# EAGLE design patch-panel (EAGLE 7.5.0)
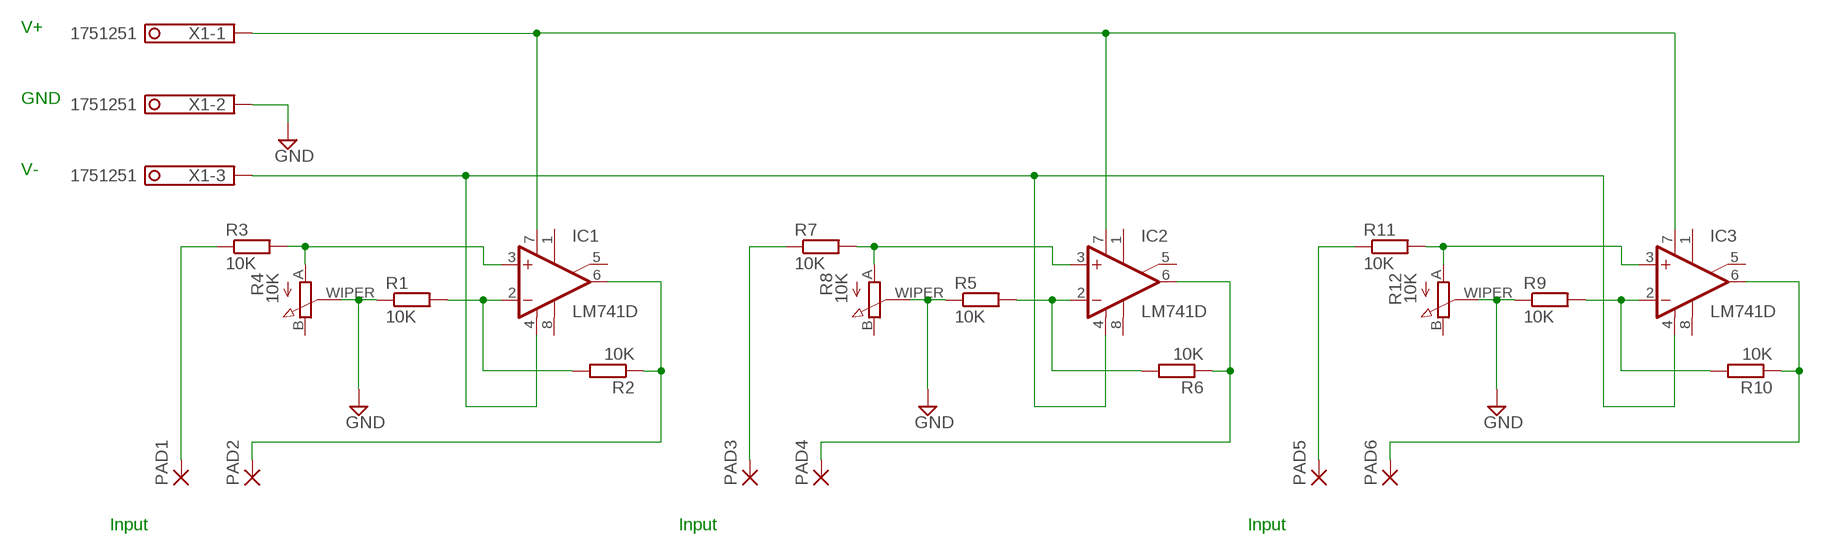
[diagram p0: schematic, sheet 1]

## Parts
IC1  LM741D  [SO08]
IC2  LM741D  [SO08]
IC3  LM741D  [SO08]
PAD1  2,54/1,0  [2,54/1,0]
PAD2  2,54/1,0  [2,54/1,0]
PAD3  2,54/1,0  [2,54/1,0]
PAD4  2,54/1,0  [2,54/1,0]
PAD5  2,54/1,0  [2,54/1,0]
PAD6  2,54/1,0  [2,54/1,0]
R1  10K  R-EU_M1206  [M1206]
R2  10K  R-EU_M1206  [M1206]
R3  10K  R-EU_M1206  [M1206]
R4  10K  PTVA09A-4  [PTVA09A-4]
R5  10K  R-EU_M1206  [M1206]
R6  10K  R-EU_M1206  [M1206]
R7  10K  R-EU_M1206  [M1206]
R8  10K  PTVA09A-4  [PTVA09A-4]
R9  10K  R-EU_M1206  [M1206]
R10  10K  R-EU_M1206  [M1206]
R11  10K  R-EU_M1206  [M1206]
R12  10K  PTVA09A-4  [PTVA09A-4]
X1  1751251  [1751251]

## Nets
N$1: IC1.2(-IN) R1.2 R2.2
N$2: IC1.6(OUT) PAD2.1(P) R2.1
N$3: IC1.3(+IN) R3.2 R4.A
N$5: R1.1 R4.WIPER R5.1 R8.WIPER R9.1 R12.WIPER X1.2 ; supply symbol labelled GND
N$6: PAD1.1(P) R3.1
N$7: IC2.2(-IN) R5.2 R6.2
N$8: IC2.6(OUT) PAD4.1(P) R6.1
N$9: IC2.3(+IN) R7.2 R8.A
N$10: PAD3.1(P) R7.1
N$11: IC1.7(V+) IC2.7(V+) IC3.7(V+) X1.1
N$14: IC3.2(-IN) R9.2 R10.2
N$15: IC3.6(OUT) PAD6.1(P) R10.1
N$16: IC3.3(+IN) R11.2 R12.A
N$17: PAD5.1(P) R11.1
N$40: IC1.4(V-) IC2.4(V-) IC3.4(V-) X1.3
Unconnected: IC1.1(ON1) IC1.5(ON2) IC1.8(OPT) IC2.1(ON1) IC2.5(ON2) IC2.8(OPT) IC3.1(ON1) IC3.5(ON2) IC3.8(OPT) R4.B R8.B R12.B

## Notes on the sheet
- V+
- GND
- V-
- Input | Input | Input

## Library data of the parts
IC1-IC3 = linear:*741: OP AMP
PAD1-PAD6 = wirepad:2,54/1,0: THROUGH-HOLE PAD
R1-R3 R5-R7 R9-R11 = rcl:R-EU_: RESISTOR, European symbol
R4 R8 R12 = bourns-PTVA09A-4:PTVA09A-4
X1 = con-phoenix-350:1751251: MKDS 1/ 3-3,5 Printklemme Nennstrom: 10 A Bemessungsspannung: 160 V Raster: 3,5 mm Polzahl: 3 Montageart: Löten Anschlussart: Schraubanschluss Anschlussrichtung vom Leiter zur Platine: 0° Source: http://eshop.phoenixcontact.com .. 1751251.pdf; OC_FARNELL: unknown; OC_NEWARK: unknown

## Board
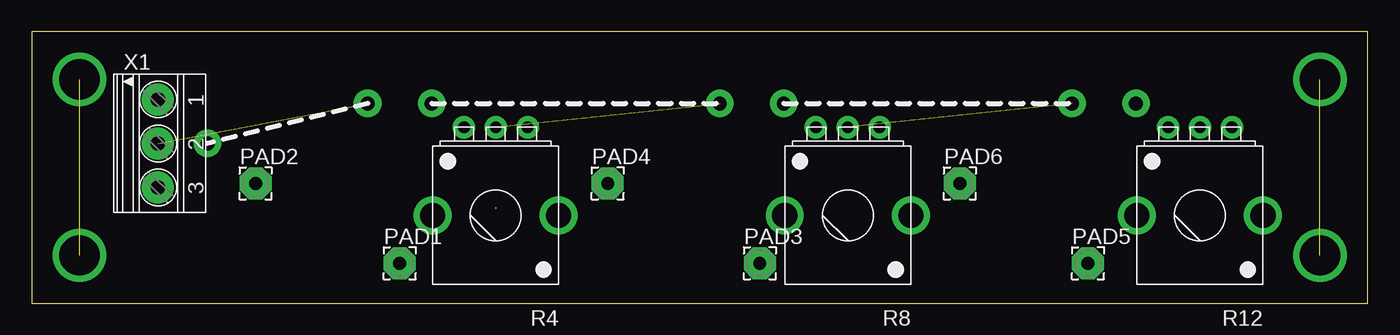
[diagram p1: board, top side]
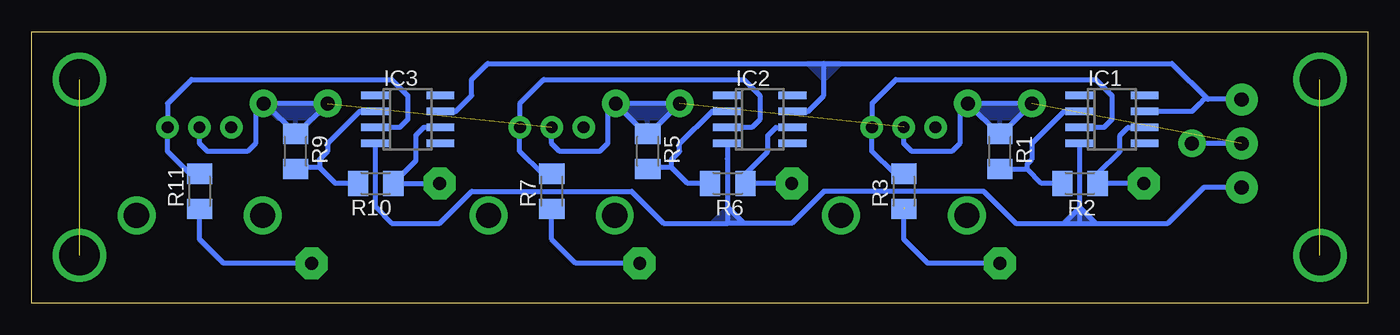
[diagram p2: board, bottom side, seen from below]

Size 106.05 x 21.59 mm. Coordinates in mm from the lower left corner, seen from the top.
Outline: 0,0 106.05,0 106.05,21.59 0,21.59 0,0
Copper layers (1*16): Top 0.035mm / dielectric 1.5mm / Bottom 0.035mm
Design rules "default": minimum track width 10mil, minimum drill 24mil, track to track 8mil, track to pad 8mil, pad to pad 8mil, via to via 8mil, smd to smd 8mil, copper to edge 40mil, drill to drill 8mil, minimum pad ring 10mil, minimum via ring 8mil, stop-mask expansion 4mil, vias tented up to drill 0mil, thermal gap 10mil

### Footprints (pad centres in the part's own frame; a part is rotated, then mirrored left to right if it is on the bottom)
SO08 = smd 0.6 x 2.2: 1 -1.905,-2.6; 2 -0.635,-2.6; 3 0.635,-2.6; 4 1.905,-2.6; 5 1.905,2.6; 6 0.635,2.6; 7 -0.635,2.6; 8 -1.905,2.6
2,54/1,0 = drill 1.016 pad 2.54 octagon: 1 0,0
M1206 = smd 1.6 x 2: 1 -1.4,0; 2 1.4,0
PTVA09A-4 = drill 0.9 pad 1.5: A -2.5,-7; B 2.5,-7; WIPER 0,-7 | drill 2 pad 2.54: P$4 -5,0; P$5 5,0
1751251 = drill 1.1 pad 1.7: 1 -3.5,-0.1; 2 0,-0.1; 3 3.5,-0.1

### Placement (x,y rotation side)
IC1  20.32,14.61 270 bottom
IC2  48.26,14.61 270 bottom
IC3  76.2,14.61 270 bottom
PAD1  29.21,3.17 0 top
PAD2  17.78,9.53 0 top
PAD3  57.78,3.17 0 top
PAD4  45.72,9.53 0 top
PAD5  83.82,3.17 0 top
PAD6  73.66,9.53 0 top
R1  29.21,12.06 270 bottom
R2  22.86,9.53 180 bottom
R3  36.83,8.89 90 bottom
R4  36.83,6.99 180 top
R5  57.15,12.06 270 bottom
R6  50.8,9.53 180 bottom
R7  64.77,8.89 90 bottom
R8  64.77,6.99 180 top
R9  85.09,12.06 270 bottom
R10  78.74,9.53 180 bottom
R11  92.71,8.89 90 bottom
R12  92.71,6.99 180 top
X1  10.16,12.7 270 top

### Tracks (layer width: path | path; a pad name or v marks a point on that pad's centre or on a via)
N$1
  Bottom 0.406: IC1.2 24.13,15.24 26.67,12.7 26.67,11.43 27.05,11.05 27.05,10.66 | R1.2 27.05,10.66 | R2.2 25.91,9.53 27.05,10.66
N$2
  Bottom 0.406: IC1.6 19.05,13.97 19.68,13.34 19.68,12.06 21.46,10.29 R2.1 PAD2.1
N$3
  Bottom 0.406: IC1.3 20.95,13.97 20.32,14.61 20.32,16.51 21.59,17.78 37.47,17.78 39.33,15.91 R4.A 39.37,13.95 39.37,12.06 37.59,10.29 R3.2
N$5  (via drill 0.9 pad 1.78, 1.1 pad 2.18)  (4 unrouted)
  Bottom 0.406: R1.1 29.34,13.46 | 29.34,13.46 29.21,13.34 v26.67,15.88 v31.75,15.88 | v31.75,15.88 29.34,13.46 | v31.75,15.88 32.38,15.24 32.38,12.7 33.02,12.06 36.2,12.06 36.83,12.7 v36.83,13.97 R4.WIPER | v59.69,15.88 v54.61,15.88 57.15,13.34 v59.69,15.88 | v59.69,15.88 60.33,15.24 60.33,12.7 60.96,12.06 64.14,12.06 64.77,12.7 v64.77,13.97 | 87.5,15.88 R9.1 84.96,13.46 v82.55,15.88 87.5,15.88 | 87.5,15.88 v87.63,15.88 88.27,15.24 88.27,12.7 88.9,12.06 92.08,12.06 92.71,12.7 v92.71,13.97 R12.WIPER
  pour Bottom (isolate 1.27): 26.67,15.88 31.75,15.88 29.21,13.34
  pour Bottom (isolate 1.27): 54.61,15.88 59.69,15.88 57.15,13.34
  pour Bottom: 82.55,15.88 87.63,15.88 85.09,13.34
N$6  (1 unrouted)
  Bottom 0.406: PAD1.1 34.92,3.17 36.83,5.08 36.83,7.62
N$7
  Bottom 0.406: R6.2 53.98,9.53 55.24,10.79 | 55.24,10.79 57.02,10.79 R5.2 | 55.24,10.79 55.24,11.43 54.61,12.06 54.61,12.7 52.07,15.24 IC2.2
N$8
  Bottom 0.406: R6.1 PAD4.1 49.53,9.53 49.53,10.16 47.62,12.06 47.62,13.34 46.99,13.97 IC2.6
N$9
  Bottom 0.406: IC2.3 48.9,13.97 48.26,14.61 48.26,16.51 49.53,17.78 65.41,17.78 67.27,15.91 R8.A 67.31,13.95 67.31,12.06 65.53,10.29 R7.2
N$10
  Bottom 0.406: PAD3.1 62.87,3.17 64.77,5.08 R7.1
N$11
  Bottom 0.406: X1.1 12.7,16.2 | 12.7,16.2 13.01,16.2 13.34,15.88 | 13.34,15.88 13.97,15.24 | 13.97,15.24 IC1.7 | IC2.7 44.45,15.24 | 43.18,16.51 43.18,19.05 | 43.18,19.05 15.55,19.05 12.7,16.2 | 44.45,15.24 43.18,16.51 | 44.45,15.24 43.18,16.51 | IC3.7 72.39,15.24 71.12,16.51 71.12,17.78 69.85,19.05 43.18,19.05 | 13.34,15.88 13.97,15.24
  pour Bottom: 43.18,17.78 41.91,19.05 44.45,19.05
N$12  (via drill 1.1 pad 2.18)
  Bottom 0.406: 10.16,12.7 v13.97,12.7
N$13  (via drill 3.2 pad 3.81)  (1 unrouted)
  other vias: 3.81,17.78 3.81,3.81
N$14
  Bottom 0.406: R10.2 81.92,9.53 83.19,10.79 | 83.19,10.79 84.96,10.79 R9.2 | IC3.2 80.01,15.24 82.55,12.7 82.55,12.06 83.19,11.43 83.19,10.79
N$15
  Bottom 0.406: PAD6.1 R10.1 75.56,11.3 75.56,13.34 74.93,13.97 IC3.6
N$16
  Bottom 0.406: IC3.3 76.83,13.97 76.2,14.61 76.2,16.51 77.47,17.78 93.34,17.78 95.25,15.88 95.21,15.84 R12.A 95.25,13.95 95.25,12.06 93.47,10.29 R11.2
N$17
  Bottom 0.406: PAD5.1 90.81,3.17 92.71,5.08 R11.1
N$18  (via drill 3.2 pad 3.81)  (1 unrouted)
  other vias: 102.23,17.78 102.23,3.81
N$19  (via drill 0.9 pad 1.78)
  other vias: 34.29,13.97
N$20  (via drill 0.9 pad 1.78)
  other vias: 39.37,13.97
N$21  (via drill 0.9 pad 1.78)
  other vias: 62.23,13.97
N$22  (via drill 0.9 pad 1.78)
  other vias: 67.31,13.97
N$23  (via drill 0.9 pad 1.78)
  other vias: 90.17,13.97
N$24  (via drill 0.9 pad 1.78)
  other vias: 95.25,13.97
N$25  (via drill 1.1 pad 2.54)
  other vias: 10,12.7
N$26  (via drill 1.1 pad 2.54)
  other vias: 10,16.19
N$27  (via drill 1.1 pad 2.54)
  other vias: 10,9.21
N$40
  Bottom 0.406: 50.86,11.49 50.8,11.43 | 22.86,6.35 22.86,7.62 | 22.86,7.62 22.86,12.64 IC1.4 | X1.3 13.01,9.21 15.88,6.35 21.59,6.35 | 24.13,6.35 27.94,6.35 30.48,8.89 43.18,8.89 45.72,6.35 49.53,6.35 | 24.13,6.35 22.86,6.35 | 22.86,6.35 21.59,6.35 | 21.59,6.35 22.86,7.62 | 22.86,7.62 24.13,6.35 | 49.53,6.35 50.8,6.35 | 50.8,6.35 50.8,7.62 | 50.8,7.62 50.8,11.43 | 50.8,11.43 50.8,12.64 IC2.4 | 49.53,6.35 50.8,7.62 | IC3.4 78.8,7.68 77.47,6.35 73.66,6.35 71.12,8.89 58.42,8.89 55.88,6.35 50.8,6.35
  pour Bottom: 21.59,6.35 22.86,7.62 24.13,6.35
  pour Bottom: 50.8,7.62 49.53,6.35 52.07,6.35